# EAGLE design lopo_ics (EAGLE 7.1.0)
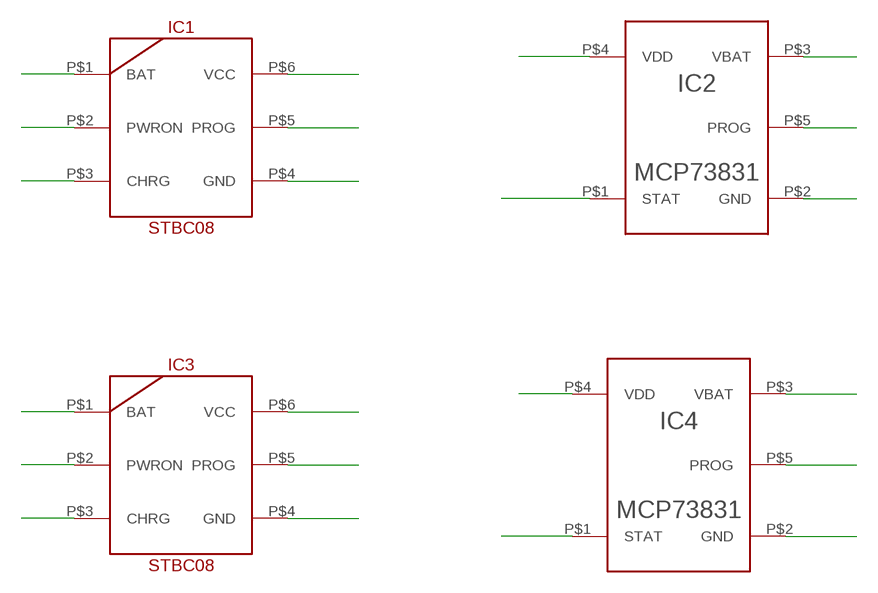
[diagram p0: schematic, sheet 1]

## Parts
IC1  STBC08  [DFN6]
IC2  MCP73831  [SOT-23-5]
IC3  STBC08  [DFN6]
IC4  MCP73831  [SOT-23-5]

## Nets
IC1P$1: IC1.P$1(BAT)
IC1P$2: IC1.P$2(PWRON)
IC1P$3: IC1.P$3(CHRG)
IC1P$4: IC1.P$4(GND)
IC1P$5: IC1.P$5(PROG)
IC1P$6: IC1.P$6(VCC)
IC2P$1: IC2.P$1(STAT)
IC2P$2: IC2.P$2(GND)
IC2P$3: IC2.P$3(VBAT)
IC2P$4: IC2.P$4(VDD)
IC2P$5: IC2.P$5(PROG)
IC3P$1: IC3.P$1(BAT)
IC3P$2: IC3.P$2(PWRON)
IC3P$3: IC3.P$3(CHRG)
IC3P$4: IC3.P$4(GND)
IC3P$5: IC3.P$5(PROG)
IC3P$6: IC3.P$6(VCC)
IC4P$1: IC4.P$1(STAT)
IC4P$2: IC4.P$2(GND)
IC4P$3: IC4.P$3(VBAT)
IC4P$4: IC4.P$4(VDD)
IC4P$5: IC4.P$5(PROG)

## Library data of the parts
IC1 IC3 = Own_misc:STBC08; INPUT: 4.25 - 6.5 V; MAXCURRENT: 800 mA; UBATT: 4.2 V
IC2 IC4 = Own_misc:MCP73831

## Board
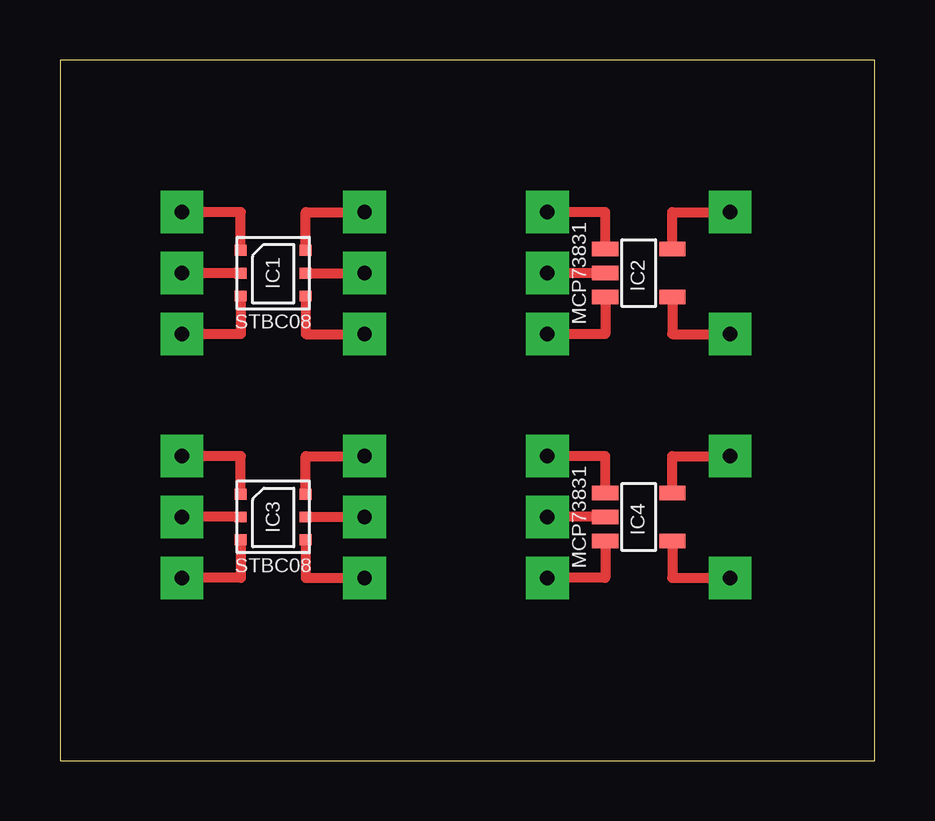
[diagram p1: board, top side]

Size 33.96 x 29.2 mm. Coordinates in mm from the lower left corner, seen from the top.
Outline: 0,0 33.96,0 33.96,29.2 0,29.2 0,0
Copper layers (1*16): Top 0.035mm / dielectric 1.5mm / Bottom 0.035mm
Design rules "default": minimum track width 10mil, minimum drill 24mil, track to track 8mil, track to pad 8mil, pad to pad 8mil, via to via 8mil, smd to smd 8mil, copper to edge 40mil, drill to drill 8mil, minimum pad ring 10mil, minimum via ring 8mil, stop-mask expansion 4mil, vias tented up to drill 0mil, thermal gap 10mil

### Footprints (pad centres in the part's own frame; a part is rotated, then mirrored left to right if it is on the bottom)
DFN6 = smd 0.5 x 0.45: P$1 -1.35,0.95; P$2 -1.35,0; P$3 -1.35,-0.95; P$4 1.35,-0.95; P$5 1.35,0; P$6 1.35,0.95
SOT-23-5 = smd 0.6 x 1.1: P$1 -1,-1.4; P$2 0,-1.4; P$3 1,-1.4; P$4 1,1.4; P$5 -1,1.4

### Placement (x,y rotation side)
IC1  8.89,20.32 0 top
IC2  24.13,20.32 270 top
IC3  8.89,10.16 0 top
IC4  24.13,10.16 270 top

### Tracks (layer width: path | path; a pad name or v marks a point on that pad's centre or on a via)
IC1P$1  (via drill 0.6 pad 1.78)
  Top 0.406: IC1.P$1 7.54,22.86 v5.08,22.86
IC1P$2  (via drill 0.6 pad 1.78)
  Top 0.406: IC1.P$2 v5.08,20.32
IC1P$3  (via drill 0.6 pad 1.78)
  Top 0.406: IC1.P$3 7.54,17.78 v5.08,17.78
IC1P$4  (via drill 0.6 pad 1.78)
  Top 0.406: IC1.P$4 10.24,17.78 v12.7,17.78
IC1P$5  (via drill 0.6 pad 1.78)
  Top 0.406: IC1.P$5 v12.7,20.32
IC1P$6  (via drill 0.6 pad 1.78)
  Top 0.406: IC1.P$6 10.24,22.86 v12.7,22.86
IC2P$1  (via drill 0.6 pad 1.78)
  Top 0.406: IC2.P$1 22.73,22.86 v20.32,22.86
IC2P$2  (via drill 0.6 pad 1.78)
  Top 0.406: IC2.P$2 v20.32,20.32
IC2P$3  (via drill 0.6 pad 1.78)
  Top 0.406: IC2.P$3 22.73,17.78 v20.32,17.78
IC2P$4  (via drill 0.6 pad 1.78)
  Top 0.406: IC2.P$4 25.53,17.78 v27.94,17.78
IC2P$5  (via drill 0.6 pad 1.78)
  Top 0.406: IC2.P$5 25.53,22.86 v27.94,22.86
IC3P$1  (via drill 0.6 pad 1.78)
  Top 0.406: IC3.P$1 7.54,12.7 v5.08,12.7
IC3P$2  (via drill 0.6 pad 1.78)
  Top 0.406: IC3.P$2 v5.08,10.16
IC3P$3  (via drill 0.6 pad 1.78)
  Top 0.406: IC3.P$3 7.54,7.62 v5.08,7.62
IC3P$4  (via drill 0.6 pad 1.78)
  Top 0.406: IC3.P$4 10.24,7.62 v12.7,7.62
IC3P$5  (via drill 0.6 pad 1.78)
  Top 0.406: IC3.P$5 v12.7,10.16
IC3P$6  (via drill 0.6 pad 1.78)
  Top 0.406: IC3.P$6 10.24,12.7 v12.7,12.7
IC4P$1  (via drill 0.6 pad 1.78)
  Top 0.406: IC4.P$1 22.73,12.7 v20.32,12.7
IC4P$2  (via drill 0.6 pad 1.78)
  Top 0.406: IC4.P$2 v20.32,10.16
IC4P$3  (via drill 0.6 pad 1.78)
  Top 0.406: IC4.P$3 22.73,7.62 v20.32,7.62
IC4P$4  (via drill 0.6 pad 1.78)
  Top 0.406: IC4.P$4 25.53,7.62 v27.94,7.62
IC4P$5  (via drill 0.6 pad 1.78)
  Top 0.406: IC4.P$5 25.53,12.7 v27.94,12.7